# EAGLE schematic h-bridge (EAGLE 8.3.2)
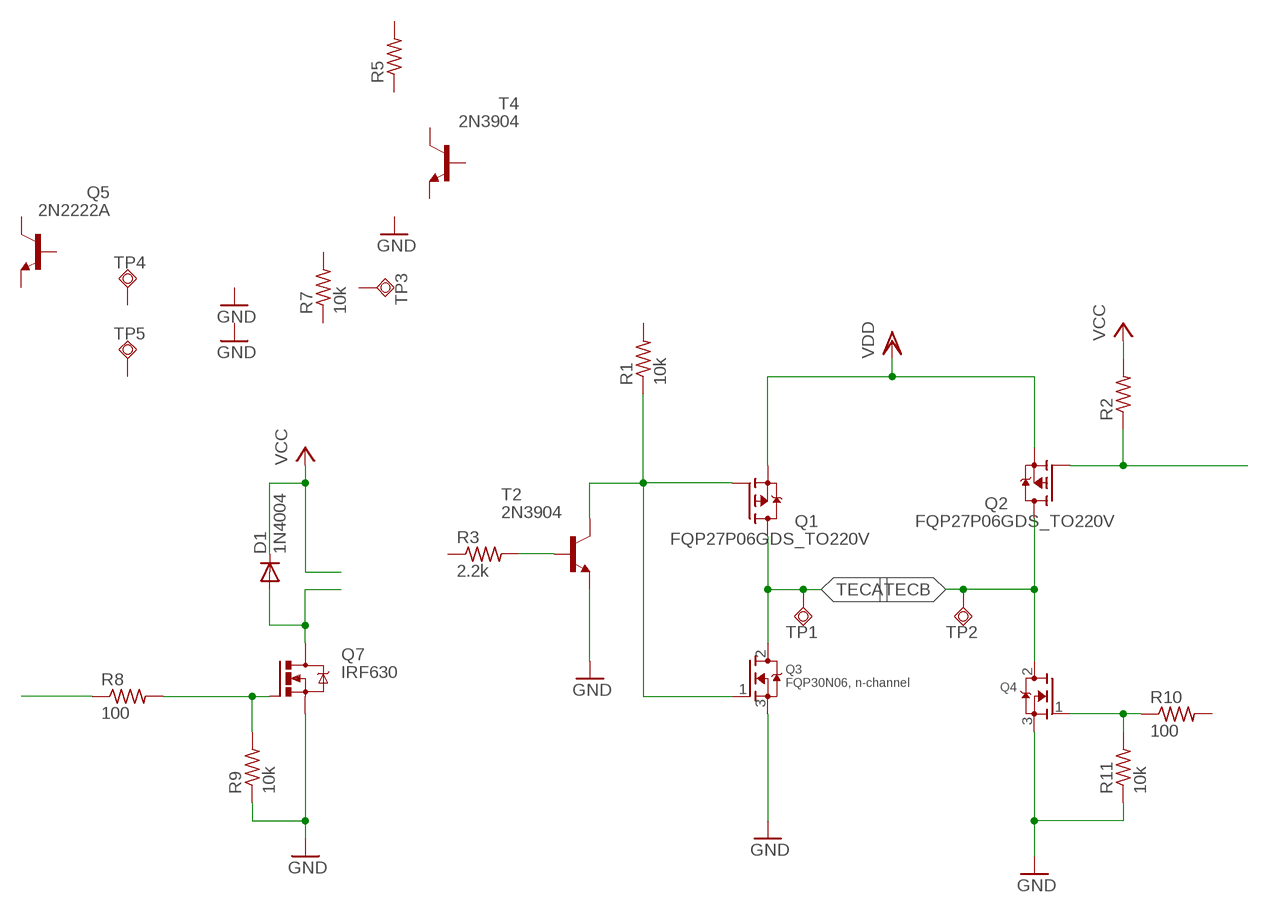
[diagram p0: schematic, sheet 1]

## Parts
D1  1N4004  [DO41-10]
Q1  FQP27P06GDS_TO220V  [TO220V]
Q2  FQP27P06GDS_TO220V  [TO220V]
Q3  FQP30N06, n-channel  FQP30N06GDS_TO220V  [TO220V]
Q4  FQP30N06GDS_TO220V  [TO220V]
Q5  2N2222A  [TO18]
Q7  IRF630  [TO220BV]
R1  10k  R-US_0207/7  [0207/7]
R2  R-US_0207/7  [0207/7]
R3  2.2k  R-US_0207/7  [0207/7]
R5  R-US_0207/7  [0207/7]
R7  10k  R-US_0207/7  [0207/7]
R8  100  R-US_0207/7  [0207/7]
R9  10k  R-US_0207/7  [0207/7]
R10  100  R-US_0207/7  [0207/7]
R11  10k  R-US_0207/7  [0207/7]
T2  2N3904  [TO92]
T4  2N3904  [TO92]
TP1  TPSQPAD1-17  [P1-17]
TP2  TPSQPAD1-17  [P1-17]
TP3  TPSQPAD1-17  [P1-17]
TP4  TPSQPAD1-17  [P1-17]
TP5  TPSQPAD1-17  [P1-17]

## Nets
GND: Q3.3(S) R9.1 R11.1 T2.3(E)
N$2: Q4.1(G) R10.1 R11.2
N$3: Q1.1(G) Q3.1(G) R1.1 T2.1(C)
N$4: Q2.1(G) R2.1
N$5: R3.2 T2.2(B)
N$8: R8.1
N$9: R8.2 R9.2
N$10: D1.A
TECA: Q1.2(D) Q3.2(D) TP1.TP
TECB: Q2.2(D) TP2.TP
VCC: D1.C R2.2
VDD: Q1.3(S) Q2.3(S)
Unconnected: Q4.2(D) Q4.3(S) Q5.1(E) Q5.2(B) Q5.3(C) Q7.D Q7.G Q7.S R1.2 R3.1 R5.1 R5.2 R7.1 R7.2 R10.2 T4.1(C) T4.2(B) T4.3(E) TP3.TP TP4.TP TP5.TP

## Library data of the parts
D1 = diode:1N4004: DIODE general purpose rectifier, 1 A
Q1 Q2 = Digikey:FQP27P06: MOSFET P-CH 60V 27A TO-220
Q3 Q4 = Digikey:FQP30N06: MOSFET N-CH 60V 30A TO-220
Q5 = transistor-npn:2N2222*: NPN Transistor
Q7 = Digikey:IRF630: MOSFET N-CH 200V 9A TO-220
R1-R3 R5 R7-R11 = adafruit:R-US_: RESISTOR, American symbol
T2 T4 = transistor:2N3904: NPN TRANSISTOR
TP1-TP5 = testpad:TPSQ: Test pad